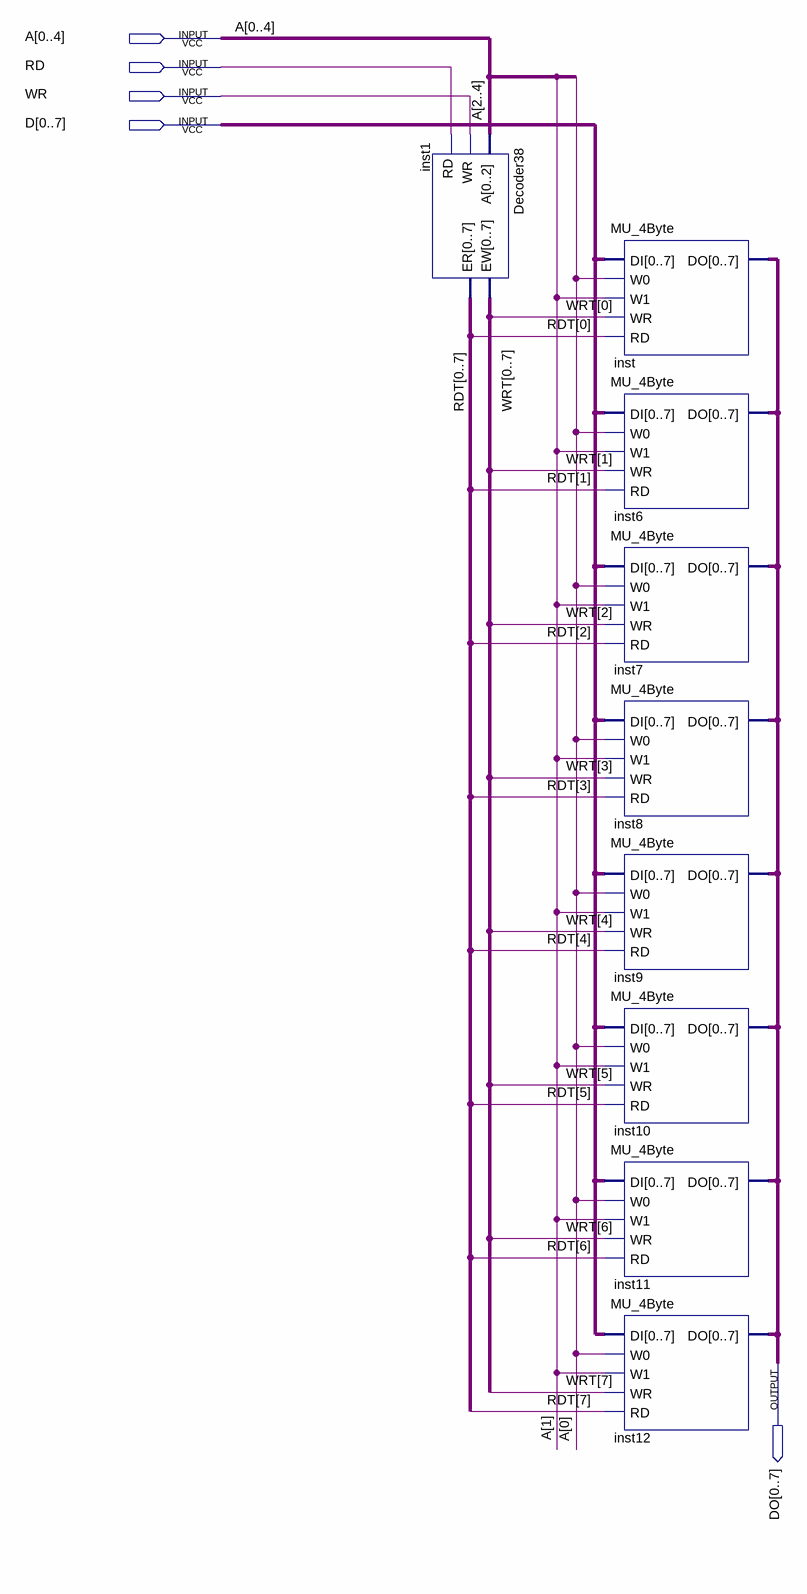
[diagram p0: schematic sheet]
// Quartus schematic MU_32Bytes.bdf as structural Verilog: 9 symbols, 5 pins
module MU_32Bytes (
  input  [0:4] A,
  input  RD,
  input  WR,
  input  [0:7] D,
  output [0:7] DO
);

  wire [7:0] RDT, WRT;

  Decoder38 inst1 (
    .A(A[2:4]), .WR(WR), .RD(RD), .EW({WRT[0], WRT[1], WRT[2], WRT[3], WRT[4], WRT[5], WRT[6], WRT[7]}),
    .ER({RDT[0], RDT[1], RDT[2], RDT[3], RDT[4], RDT[5], RDT[6], RDT[7]}));
  MU_4Byte inst (.DI(D), .W0(A[0]), .W1(A[1]), .WR(WRT[0]), .RD(RDT[0]), .DO(DO));
  MU_4Byte inst6 (.DI(D), .W0(A[0]), .W1(A[1]), .WR(WRT[1]), .RD(RDT[1]), .DO(DO));
  MU_4Byte inst7 (.DI(D), .W0(A[0]), .W1(A[1]), .WR(WRT[2]), .RD(RDT[2]), .DO(DO));
  MU_4Byte inst8 (.DI(D), .W0(A[0]), .W1(A[1]), .WR(WRT[3]), .RD(RDT[3]), .DO(DO));
  MU_4Byte inst9 (.DI(D), .W0(A[0]), .W1(A[1]), .WR(WRT[4]), .RD(RDT[4]), .DO(DO));
  MU_4Byte inst10 (.DI(D), .W0(A[0]), .W1(A[1]), .WR(WRT[5]), .RD(RDT[5]), .DO(DO));
  MU_4Byte inst11 (.DI(D), .W0(A[0]), .W1(A[1]), .WR(WRT[6]), .RD(RDT[6]), .DO(DO));
  MU_4Byte inst12 (.DI(D), .W0(A[0]), .W1(A[1]), .WR(WRT[7]), .RD(RDT[7]), .DO(DO));
endmodule
